# EAGLE design trac_temp (EAGLE 7.7.0)
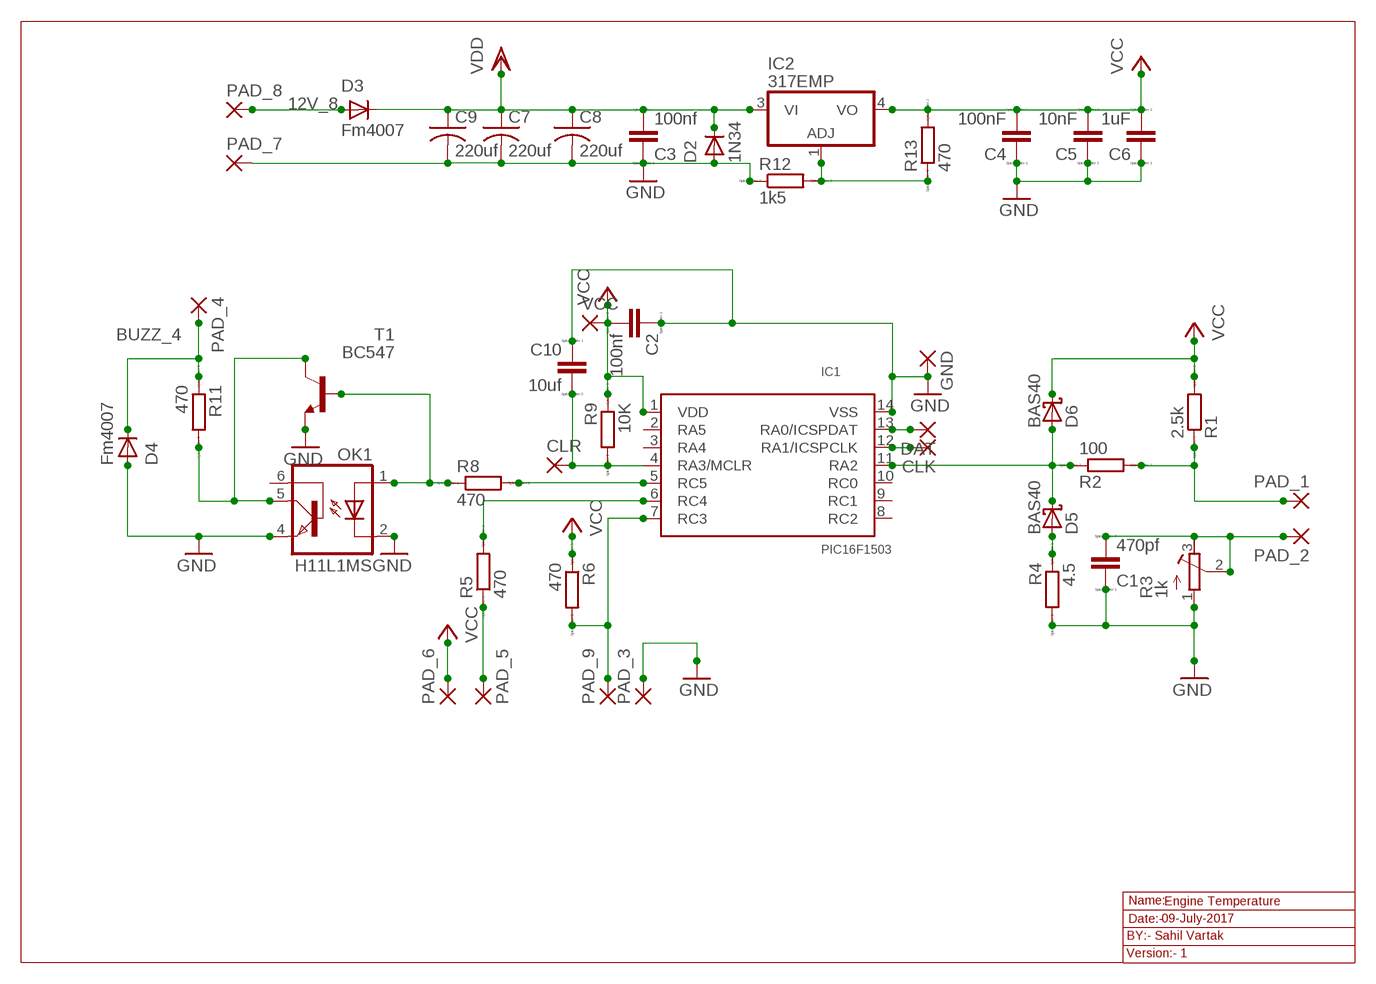
[diagram p0: schematic, sheet 1]

## Parts
C1  470pf  CC0603  [C0603]
C2  100nf  CC0603  [C0603]
C3  100nf  CC0603  [C0603]
C4  100nF  CC0603  [C0603]
C5  10nF  CC0603  [C0603]
C6  1uF  CC0603  [C0603]
C7  220uf  C-US025-025X050  [C025-025X050]
C8  220uf  C-US025-025X050  [C025-025X050]
C9  220uf  C-US025-025X050  [C025-025X050]
C10  10uf  CC0603  [C0603]
CLK  1,6/0,8  [1,6/0,8]
CLR  1,6/0,8  [1,6/0,8]
D2  1N34  GF1  [SMA-DO214AC]
D3  Fm4007  GF1  [SMA-DO214AC]
D4  Fm4007  GF1  [SMA-DO214AC]
D5  BAS40  [SOT23]
D6  BAS40  [SOT23]
DAT  1,6/0,8  [1,6/0,8]
GND  1,6/0,8  [1,6/0,8]
IC1  PIC16F1503  PIC16F1824  [SO-14]
IC2  317EMP  [SOT223]
OK1  H11L1MS  [DIL6-SMD]
PAD_1  2,54/1,1  [2,54/1,1]
PAD_2  2,54/1,1  [2,54/1,1]
PAD_3  2,54/1,1  [2,54/1,1]
PAD_4  2,54/1,1  [2,54/1,1]
PAD_5  2,54/1,1  [2,54/1,1]
PAD_6  2,54/1,1  [2,54/1,1]
PAD_7  2,54/1,1  [2,54/1,1]
PAD_8  2,54/1,1  [2,54/1,1]
PAD_9  2,54/1,1  [2,54/1,1]
R1  2.5k  RR0603  [R0603]
R2  100  RR0603  [R0603]
R3  1k  R-TRIMM3103  [RTRIM3103]
R4  4.5  RR0603  [R0603]
R5  470  RR0603  [R0603]
R6  470  RR0603  [R0603]
R8  470  RR0603  [R0603]
R9  10K  RR0603  [R0603]
R11  470  RR0603  [R0603]
R12  1k5  RR0603  [R0603]
R13  470  RR0603  [R0603]
T1  BC547  [TO92]
VCC  1,6/0,8  [1,6/0,8]

## Nets
12V_8: D3.A PAD_8.1(P)
BUZZ_4: D4.K(C) PAD_4.1(P) R11.1
GND: C1.1 C2.1 C3.1 C4.1 C5.1 C6.1 C7.2 C8.2 C9.2 C10.1 D2.A D4.A GND.1(P) IC1.14(VSS) OK1.2(C) OK1.4(EMI) PAD_3.1(P) PAD_7.1(P) R3.1(A) R4.2 R12.1 T1.1(E)
N$3: PAD_1.1(P) R1.1 R2.2
N$5: D5.1(A) R4.1
N$7: C1.2 PAD_2.1(P) R3.2(S) R3.3(E)
N$8: DAT.1(P) IC1.13(RA0/ICSPDAT)
N$9: CLK.1(P) IC1.12(RA1/ICSPCLK)
N$13: C10.2 CLR.1(P) IC1.4(RA3/MCLR) R9.2
N$14: IC2.1(ADJ) R12.2 R13.1
N$15: D5.3(C) D6.1(A) IC1.11(RA2) R2.1
N$16: IC1.5(RC5) R8.2
N$17: PAD_5.1(P) R5.1
N$18: IC1.6(RC4) R5.2
N$20: IC1.7(RC3) PAD_9.1(P) R6.2
N$89: OK1.1(A) R8.1 T1.2(B)
N$90: OK1.5(COL) R11.2 T1.3(C)
VCC: C2.2 C4.2 C5.2 C6.2 D6.3(C) IC1.1(VDD) IC2.4(VO) PAD_6.1(P) R1.2 R6.1 R9.1 R13.2 VCC.1(P)
VDD: C3.2 C7.1 C8.1 C9.1 D2.K(C) D3.K(C) IC2.3(VI)
Unconnected: IC1.2(RA5) IC1.3(RA4) IC1.8(RC2) IC1.9(RC1) IC1.10(RC0) OK1.6(BAS)

## Notes on the sheet
- Name:- | Engine Temperature
- Date:- | 09-July-2017
- BY:- Sahil Vartak
- Version:- 1

## Library data of the parts
C1-C6 C10 = eagle-ltspice:C: CAPACITOR, European symbol; SPICEMODEL: NONE; SPICEPREFIX: C
C7-C9 = rcl:C-US: CAPACITOR, American symbol
CLK CLR DAT GND VCC = wirepad:1,6/0,8: THROUGH-HOLE PAD
D2-D4 = diode:GF1: DIODE
D5 D6 = diode:BAS40: Silicon Schottky Diodes General-purpose diode for high-speed switching
IC1 = microchip:PIC16F1824
IC2 = lm317:*317: Positive VOLTAGE REGULATOR
OK1 = optocoupler:H11L*M: 6-Pin DIP Optocoupler Source: http://www.fairchildsemi.com/ds/H1/H11L2-M.pdf; OC_FARNELL: unknown; OC_NEWARK: unknown
PAD_1-PAD_9 = wirepad:2,54/1,1: THROUGH-HOLE PAD
R1 R2 R4-R6 R8 R9 R11-R13 = eagle-ltspice:R: RESISTOR, European symbol; SPICEMODEL: NONE; SPICEPREFIX: R
R3 = rcl:R-TRIMM: Trimm resistor
T1 = transistor-neu-to92:BC547: NPN TRANSISTOR

## Board
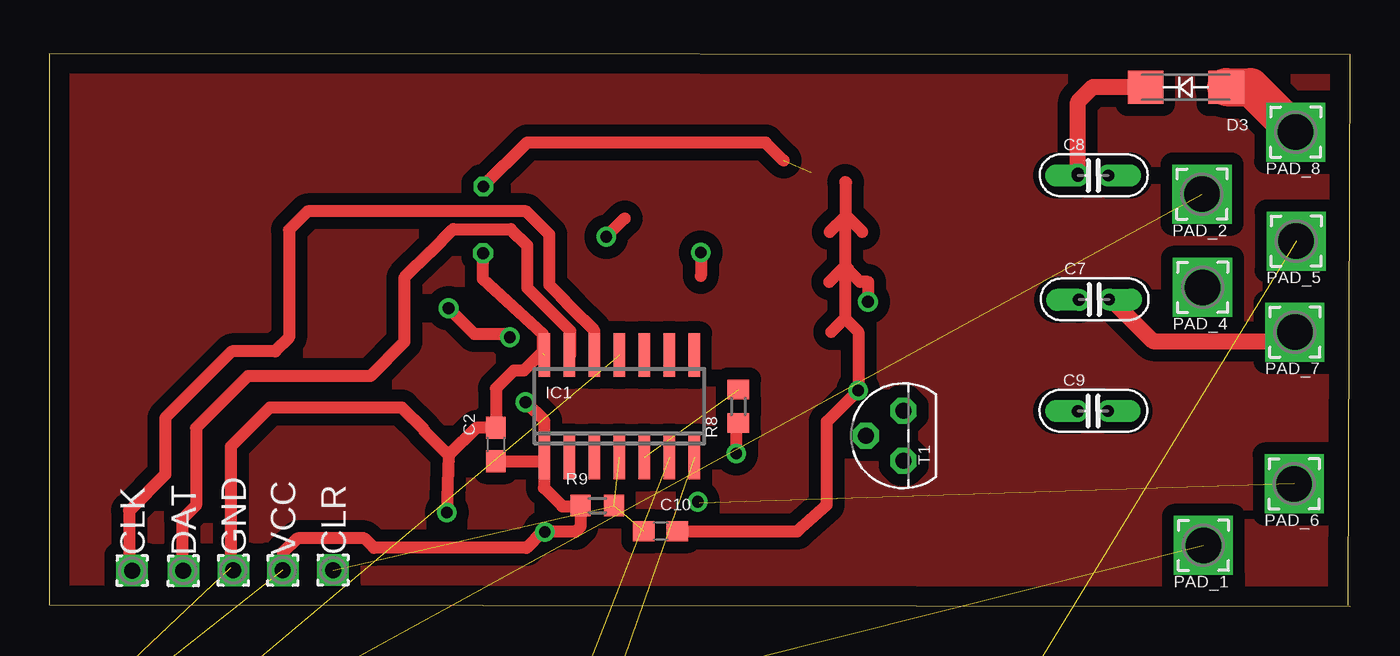
[diagram p1: board, top side]
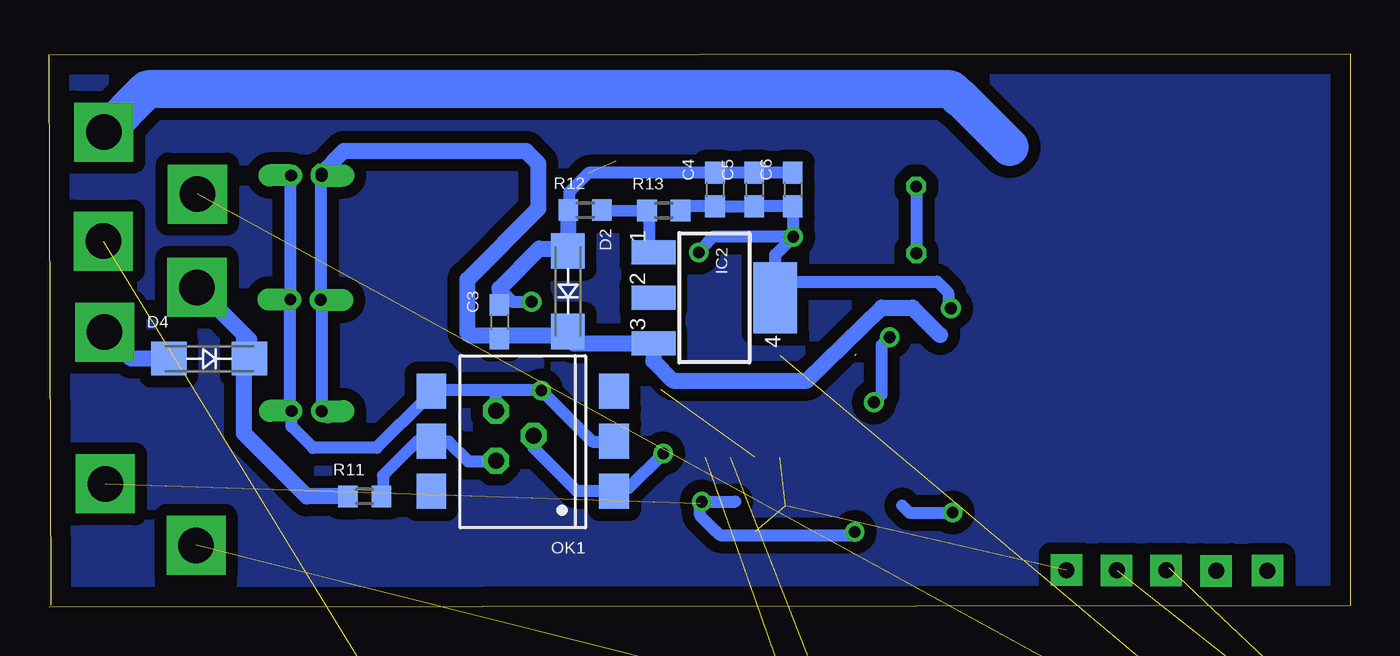
[diagram p2: board, bottom side, seen from below]

Size 66.1 x 28.07 mm. Coordinates in mm from the lower left corner, seen from the top.
Outline: 66,0.06 66.1,28.01 0,28.07 0,0.06 66.1,0
Copper layers (1*16): Top 0.035mm / dielectric 1.5mm / Bottom 0.035mm
Design rules "default": minimum track width 10mil, minimum drill 24mil, track to track 8mil, track to pad 8mil, pad to pad 8mil, via to via 8mil, smd to smd 8mil, copper to edge 40mil, drill to drill 8mil, minimum pad ring 10mil, minimum via ring 8mil, stop-mask expansion 4mil, vias tented up to drill 0mil, thermal gap 10mil

### Footprints (pad centres in the part's own frame; a part is rotated, then mirrored left to right if it is on the bottom)
C0603 = smd 1.1 x 1: 1 -0.85,0; 2 0.85,0
C025-025X050 = drill 0.6 pad 0.889 offset: 1 -0.776,-0.006; 2 0.759,0.007
1,6/0,8 = drill 0.813 pad 1.6 square: 1 0,0
SMA-DO214AC = smd 1.8 x 1.7: A -2.05,0; K 2.05,0
SOT23 = smd 1 x 1.4: 1 -0.95,-1.1; 2 0.95,-1.1; 3 0,1.1
SO-14 = smd 0.6 x 2.2: 1 -3.81,-2.6; 2 -2.54,-2.6; 3 -1.27,-2.6; 4 0,-2.6; 5 1.27,-2.6; 6 2.54,-2.6; 7 3.81,-2.6; 8 3.81,2.6; 9 2.54,2.6; 10 1.27,2.6; 11 0,2.6; 12 -1.27,2.6; 13 -2.54,2.6; 14 -3.81,2.6
SOT223 = smd 1.219 x 2.235: 1 -2.311,-3.099; 2 0,-3.099; 3 2.311,-3.099 | smd 3.6 x 2.2: 4 0,3.099
DIL6-SMD = smd 1.78 x 1.52: 1 -2.54,-4.645; 2 0,-4.645; 3 2.54,-4.645; 4 2.54,4.645; 5 0,4.645; 6 -2.54,4.645
2,54/1,1 = drill 1.8 pad 3 square: 1 0,0
R0603 = smd 1 x 1.1: 1 -0.85,0; 2 0.85,0
RTRIM3103 = smd 1.2 x 1.25: 1 -1,-1.225; 3 1,-1.225 | smd 1.3 x 1.3: 2 0,1.3
TO92 = drill 0.813 octagon: 1 1.27,0; 2 0,1.905; 3 -1.27,0

### Placement (x,y rotation side)
C1  -16.04,-49.13 0 top  (outside the outline)
C2  22.69,8.23 270 top
C3  43.23,14.46 270 bottom
C4  32.28,21.18 270 bottom
C5  30.28,21.17 270 bottom
C6  28.32,21.18 270 bottom
C7  53.09,15.58 0 top
C8  53.04,21.88 0 top
C9  53.03,9.92 0 top
C10  31.06,3.82 180 top
CLK  4.21,1.82 0 top
CLR  14.42,1.84 0 top
D2  39.75,16.01 270 bottom
D3  57.74,26.37 180 top
D4  57.97,12.58 0 bottom
D5  -16.31,-31.74 0 top  (outside the outline)
D6  -16.31,-39.03 0 top  (outside the outline)
DAT  6.81,1.8 0 top
GND  9.35,1.83 0 top
IC1  28.96,10.17 0 top
IC2  32.31,15.68 270 bottom
OK1  42.04,8.38 90 bottom
PAD_1  58.64,3.11 180 top
PAD_2  58.57,20.94 180 top
PAD_3  -3.72,-66.32 0 top  (outside the outline)
PAD_4  58.59,16.21 180 top
PAD_5  63.35,18.56 180 top
PAD_6  63.25,6.23 180 top
PAD_7  63.28,13.94 180 top
PAD_8  63.32,24.09 180 top
PAD_9  -3.72,-96.32 0 top  (outside the outline)
R1  -9.32,-14.18 0 top  (outside the outline)
R2  -16.61,-26.3 0 top  (outside the outline)
R3  -15.13,-20.71 0 top  (outside the outline)
R4  -16.61,-45 0 top  (outside the outline)
R5  -16.61,-113.61 0 top  (outside the outline)
R6  -16.61,-117.73 0 top  (outside the outline)
R8  35.01,10.17 90 top
R9  27.85,5.12 0 top
R11  50.08,5.59 0 bottom
R12  38.88,20.13 0 bottom
R13  34.88,20.11 0 bottom
T1  43.4,8.67 90 top
VCC  11.86,1.83 0 top

### Tracks (layer width: path | path; a pad name or v marks a point on that pad's centre or on a via)
12V_8
  Top 1.93: D3.A 61.04,26.37 PAD_8.1
  Bottom 1.93: PAD_8.1 63.28,24.09 61.11,26.26 20.3,26.26 19.89,25.85 19.83,25.85 17.3,23.33
BUZZ_4
  Bottom 0.813: R11.1 53.02,5.59 56.2,8.77 56.2,13.81 | 56.2,13.81 PAD_4.1 | D4.K 55.92,13.53 56.2,13.81
GND  (via drill 0.6)  (6 unrouted)
  Top 0.61: 39.64,19.03 40.44,19.83 | 40.48,19.86 40.48,21.53 40.44,21.57 | 41.31,19.03 40.48,19.86 | 40.48,17.26 40.59,17.15 40.59,17.1 41.2,16.49 41.6,16.49 v41.6,15.47 | 40.48,17.26 40.44,17.3 | 40.44,17.3 40.44,19.83 | 40.44,19.83 40.48,19.86 | 39.63,16.49 40.44,17.3 | 40.42,14.63 41.1,13.95 v41.1,10.97 | 40.48,17.26 40.42,17.2 40.42,14.63 | 20.3,7.67 21.7,9.08 C2.1 22.7,9.09 22.7,11.07 23.6,11.97 24.1,11.97 24.96,12.84 25.09,12.84 25.09,13.83 22.04,16.62 v22.04,17.93 v22.05,17.94 | 20.3,7.67 v20.2,4.77 | 39.73,13.95 40.42,14.63 | v41.1,10.97 | C10.1 38,3.81 39.51,5.16 39.51,9.38 v41.1,10.97 | 20.3,7.67 19.07,8.9 19.07,8.94 17.91,10.1 11.21,10.1 9.22,8.11 9.22,1.96 GND.1 | 37.3,22.65 36.39,23.56 24.28,23.56 v22.05,21.33
  Top 0.813: C7.2 54.36,15.18 56.07,13.47 62.82,13.47 PAD_7.1
  Bottom 0.61: C5.1 | C6.1 C5.1 | 43.23,16.15 42.55,15.47 v41.6,15.47 | 22.76,5.13 22.4,4.77 v20.2,4.77 | 43.3,10.97 v41.1,10.97 38.5,8.37 OK1.2 | 43.3,10.97 46.82,10.97 | 46.82,10.97 46.98,10.97 46.98,10.53 49.46,8.05 52.69,8.05 53.79,9.15 C9.2 53.85,9.93 C7.2 53.85,21.89 C8.2 | T1.1 43.4,10.87 43.3,10.97 | OK1.4 46.77,10.92 46.82,10.97 | R12.1 39.68,20.18 39.68,21.04 38.7,22.03 C4.1 C5.1 | v22.05,21.33 22.05,18.2 v22.05,17.94
  Bottom 0.813: 39.93,17.77 D2.A | R12.1 39.76,17.95 D2.A | D2.A 39.86,18.17 41.2,18.17 43.23,16.15 C3.1 43.27,15.26 | D4.A 61.93,12.58 PAD_7.1
N$1
  pour Bottom (isolate 0.61): 66,0.06 0,0.06 0,27.97 66,27.97
N$3  (2 unrouted)
N$5  (1 unrouted)
N$6
  pour Top (isolate 0.61): 65.9,0.06 0,0.06 0,27.97 65.9,27.97
N$7  (3 unrouted)
N$8
  Top 0.61: 19.39,18.01 19.39,18.02 | 19.39,18.02 20.53,19.16 23.45,19.16 24.28,18.33 24.28,16.18 26.46,14 26.46,12.81 IC1.13 | 19.39,18.02 19.38,18.02 18.04,16.68 18.04,13.43 16.31,11.7 10.09,11.7 7.46,9.07 7.46,5.13 6.75,4.42 6.75,1.86 DAT.1
N$9
  Top 0.61: IC1.12 27.69,13.99 26.51,15.17 26.51,15.2 26.02,15.69 26.02,15.71 25.41,16.32 25.41,18.88 24.23,20.06 13.12,20.06 12.18,19.12 12.18,13.65 11.48,12.95 9.28,12.95 5.9,9.57 5.9,6.71 4.06,4.87 4.06,1.97 CLK.1
N$13  (3 unrouted)
N$14
  Bottom 0.61: IC2.1 35.6,18.18 35.6,19.98 R13.1 R12.2
N$15  (3 unrouted)
N$16  (1 unrouted)
N$17  (1 unrouted)
N$18  (1 unrouted)
N$20  (2 unrouted)
N$89  (via drill 0.6)
  Top 0.61: R8.1 34.9,9.31 v34.9,7.77
  Bottom 0.61: 35,7.67 v34.9,7.77 36.66,6.02 37.55,6.02 | 37.75,6.02 37.55,6.02 | 37.55,5.87 39.3,5.87 41.49,8.07 T1.2 | OK1.1 37.39,5.87 37.55,5.87 | 37.55,5.87 37.55,6.02
N$90
  Bottom 0.61: 49.4,5.77 R11.2 49.14,5.68 49.14,6.66 47.43,8.37 OK1.5 | T1.3 43.43,7.37 44.8,7.37 45.8,8.37 OK1.5 | OK1.5
VCC  (via drill 0.6)  (4 unrouted)
  Top 0.61: C2.2 24.96,7.38 25.14,7.55 | 26.97,5.09 R9.1 | 25.14,7.55 IC1.1 25.15,9.42 v24.2,10.37 | R9.1 | v33.1,17.97 33.1,16.79 | 28.36,18.71 v28.3,18.77 | v32.95,5.32 | 28.37,18.7 v28.3,18.77 | 29.24,19.71 v28.3,18.77 | 25.14,7.55 25.14,6.02 26.07,5.08 26.96,5.08 R9.1 | R9.1 27,5.11 26.99,5.11 26.99,4.04 26.73,3.79 v25.18,3.79 | v25.18,3.79 v25.18,3.78 | 23.36,13.71 v23.4,13.67 23.24,13.83 21.6,13.83 v20.29,15.14 | v25.18,3.79 25.04,3.79 24.24,2.98 16.5,2.98 16.02,3.46 12.61,3.46 11.87,2.72 VCC.1
  Bottom 0.61: v28.3,18.77 28.3,20.3 C6.2 C5.2 C4.2 33.53,20.32 R13.2 | 31.25,5.32 v32.95,5.32 33.03,5.24 33.03,4.61 32.22,3.8 32.2,3.8 32.02,3.62 25.34,3.62 v25.18,3.78 | v28.3,18.77 32.4,18.77 v33.1,17.97 | 29.21,16.22 IC2.4 28.86,16.02 | 29.21,16.22 29.21,17.87 v28.3,18.77 | v24.2,10.37 23.8,10.77 23.8,13.27 v23.4,13.67 | 29.06,16.07 29.21,16.22 | 28.79,16.09 28.86,16.02 | 28.86,16.02 28.86,16.16 28.53,16.49 20.98,16.49 20.42,15.93 20.42,15.27 v20.29,15.14
VDD  (via drill 0.6)
  Top 0.813: v52.26,21.99 52.26,25.63 53.02,26.38 55.68,26.38 D3.K
  Bottom 0.61: 39.45,13.37 D2.K | C8.1 52.31,21.88 C7.1 52.25,15.58 C9.1 51.94,9.6
  Bottom 0.813: 43.29,13.67 C3.2 | D2.K 39.95,13.76 43.08,13.76 | 39.45,13.37 IC2.3 35.4,12.48 34.4,11.47 27.6,11.47 23.8,15.17 22.24,15.17 20.85,13.78 | 43.3,13.53 C3.2 | 43.27,13.56 C3.2 | C8.1 v52.26,21.99 51.13,23.12 41.87,23.12 41.24,22.49 41.24,20.21 44.85,16.6 44.85,13.9 44.71,13.76 43.08,13.76 | 43.08,13.76 C3.2